# EAGLE design vco (EAGLE 7.5.0)
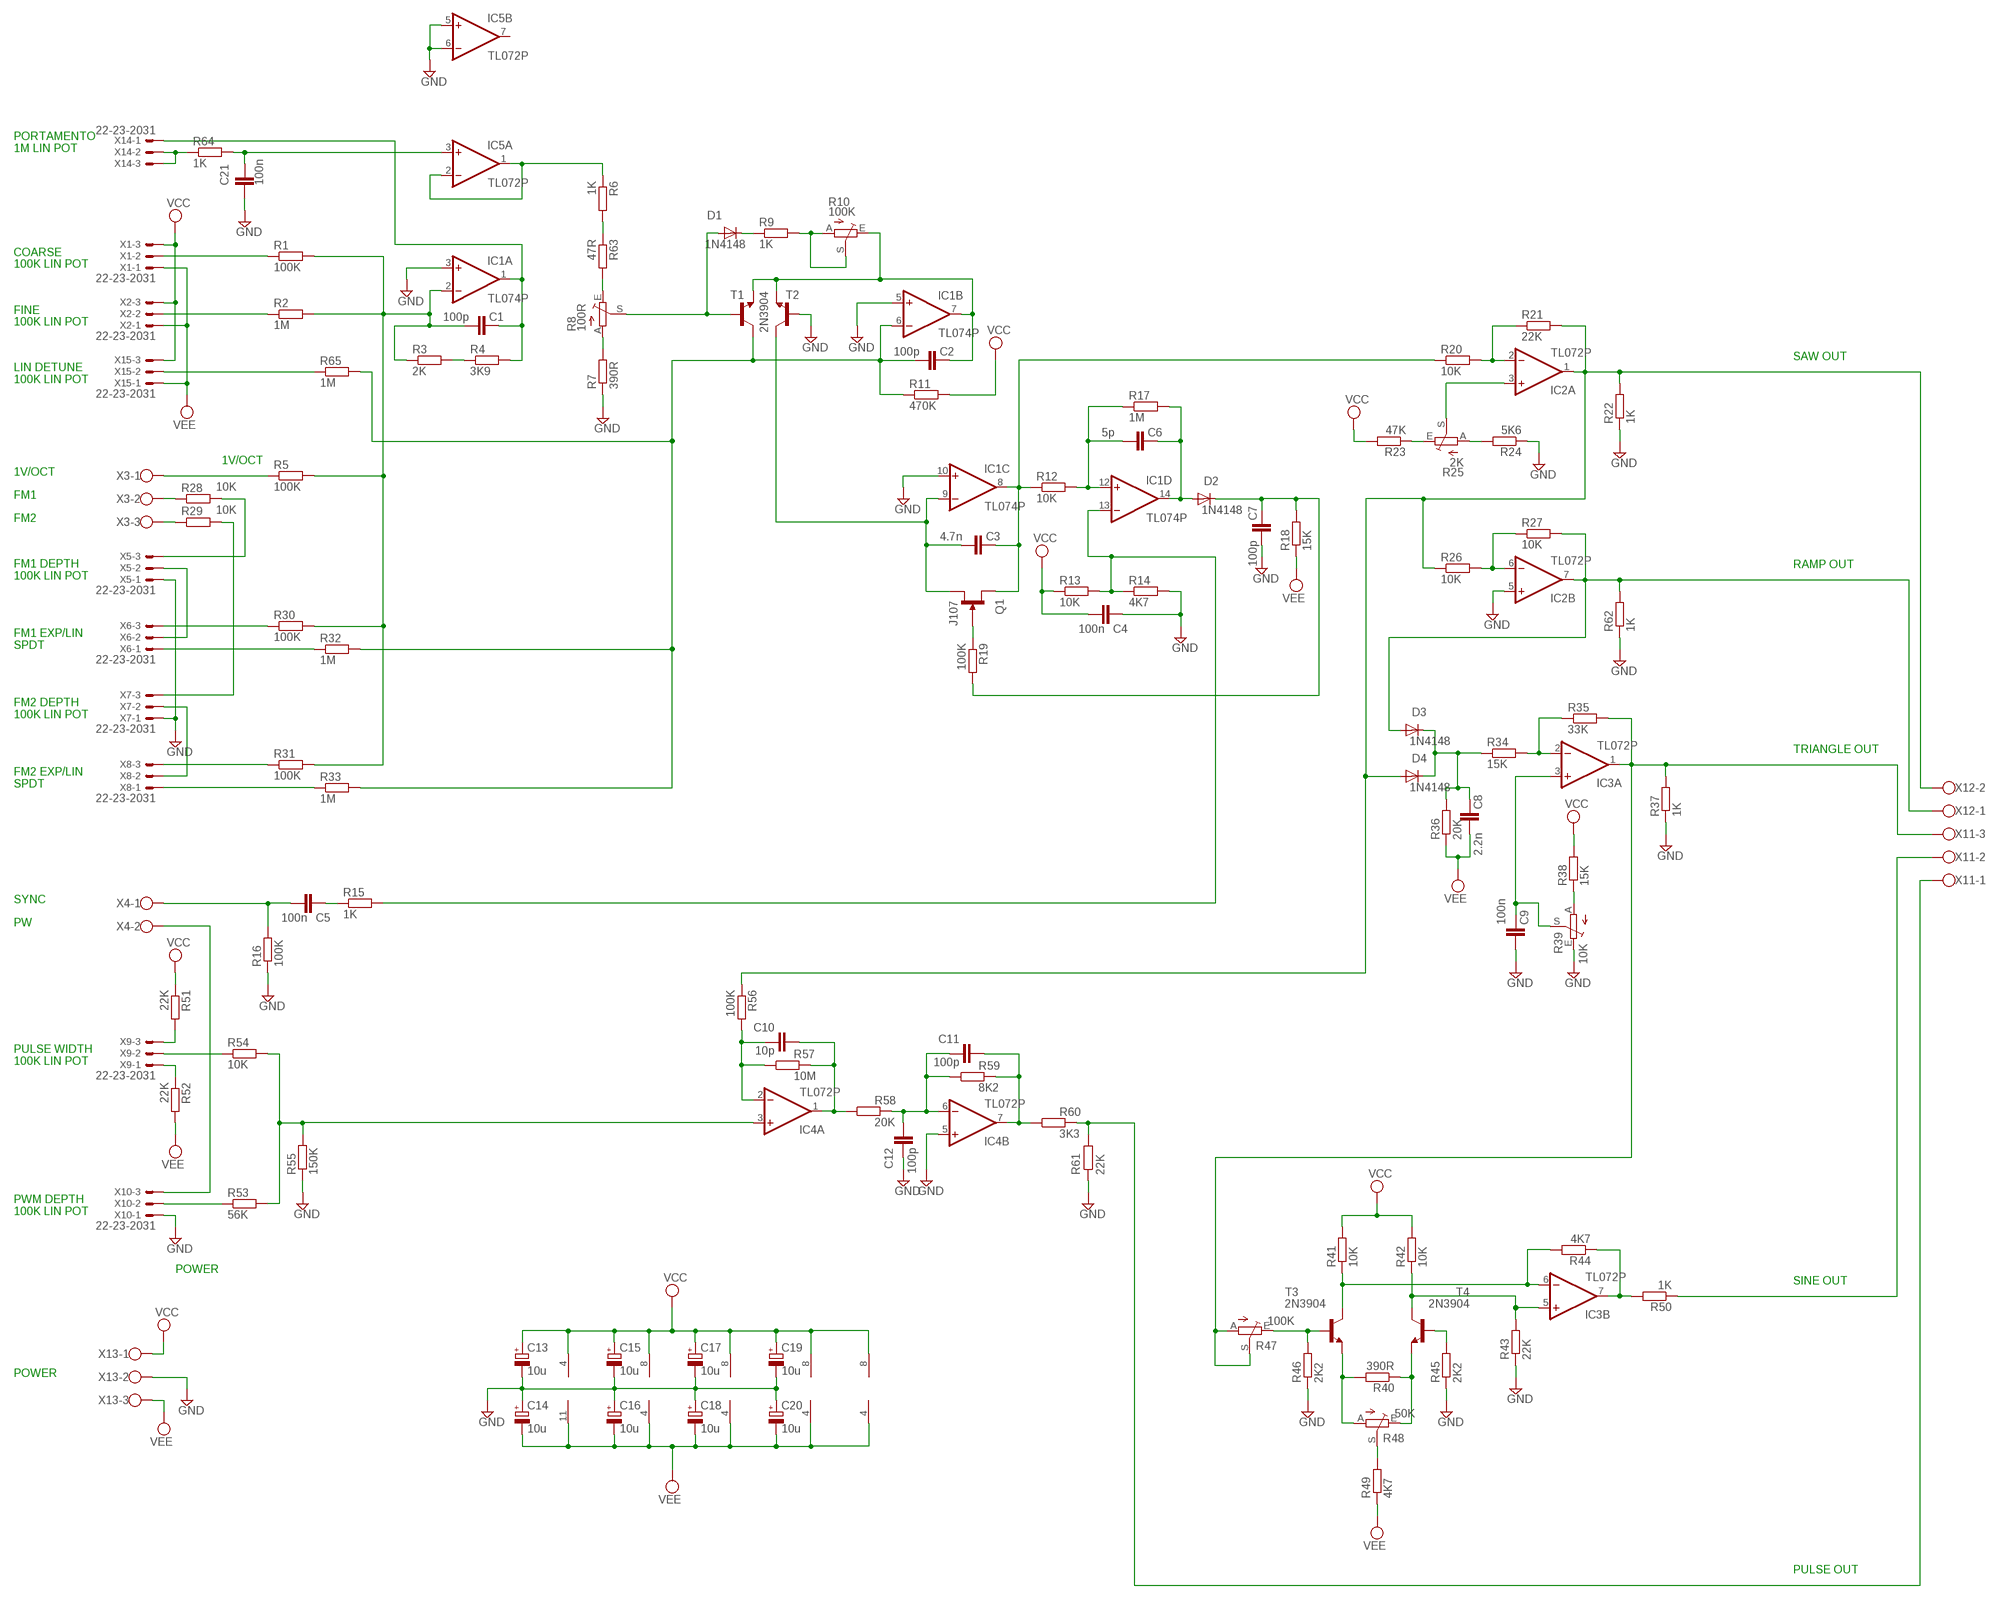
[diagram p0: schematic, sheet 1]

## Parts
C1  100p  C-EU025-024X044  [C025-024X044]
C2  100p  C-EU025-024X044  [C025-024X044]
C3  4.7n  C-EU025-024X044  [C025-024X044]
C4  100n  C-EU025-024X044  [C025-024X044]
C5  100n  C-EU025-024X044  [C025-024X044]
C6  5p  C-EU025-024X044  [C025-024X044]
C7  100p  C-EU025-024X044  [C025-024X044]
C8  2.2n  C-EU025-024X044  [C025-024X044]
C9  100n  C-EU025-024X044  [C025-024X044]
C10  10p  C-EU025-024X044  [C025-024X044]
C11  100p  C-EU025-024X044  [C025-024X044]
C12  100p  C-EU025-024X044  [C025-024X044]
C13  10u  CPOL-EUE1.8-4  [E1,8-4]
C14  10u  CPOL-EUE1.8-4  [E1,8-4]
C15  10u  CPOL-EUE1.8-4  [E1,8-4]
C16  10u  CPOL-EUE1.8-4  [E1,8-4]
C17  10u  CPOL-EUE1.8-4  [E1,8-4]
C18  10u  CPOL-EUE1.8-4  [E1,8-4]
C19  10u  CPOL-EUE1.8-4  [E1,8-4]
C20  10u  CPOL-EUE1.8-4  [E1,8-4]
C21  100n  C-EU025-024X044  [C025-024X044]
D1  1N4148  1N4148DO35-7  [DO35-7]
D2  1N4148  1N4148DO35-7  [DO35-7]
D3  1N4148  1N4148DO35-7  [DO35-7]
D4  1N4148  1N4148DO35-7  [DO35-7]
IC1  TL074P  [DIL14]
IC2  TL072P  [DIL08]
IC3  TL072P  [DIL08]
IC4  TL072P  [DIL08]
IC5  TL072P  [DIL08]
Q1  J107  J105  [TO92R]
R1  100K  R-EU_0204/7  [0204/7]
R2  1M  R-EU_0204/7  [0204/7]
R3  2K  R-EU_0309/12  [0309/12]
R4  3K9  R-EU_0204/7  [0204/7]
R5  100K  R-EU_0204/7  [0204/7]
R6  1K  R-EU_0204/7  [0204/7]
R7  390R  R-EU_0204/7  [0204/7]
R8  100R  TRIM_EU-B64Y  [B64Y]
R9  1K  R-EU_0204/7  [0204/7]
R10  100K  TRIM_EU-B64Y  [B64Y]
R11  470K  R-EU_0204/7  [0204/7]
R12  10K  R-EU_0204/7  [0204/7]
R13  10K  R-EU_0204/7  [0204/7]
R14  4K7  R-EU_0204/7  [0204/7]
R15  1K  R-EU_0204/7  [0204/7]
R16  100K  R-EU_0204/7  [0204/7]
R17  1M  R-EU_0204/7  [0204/7]
R18  15K  R-EU_0204/7  [0204/7]
R19  100K  R-EU_0204/7  [0204/7]
R20  10K  R-EU_0204/7  [0204/7]
R21  22K  R-EU_0204/7  [0204/7]
R22  1K  R-EU_0204/7  [0204/7]
R23  47K  R-EU_0204/7  [0204/7]
R24  5K6  R-EU_0204/7  [0204/7]
R25  2K  TRIM_EU-B64Y  [B64Y]
R26  10K  R-EU_0204/7  [0204/7]
R27  10K  R-EU_0204/7  [0204/7]
R28  10K  R-EU_0204/7  [0204/7]
R29  10K  R-EU_0204/7  [0204/7]
R30  100K  R-EU_0204/7  [0204/7]
R31  100K  R-EU_0204/7  [0204/7]
R32  1M  R-EU_0204/7  [0204/7]
R33  1M  R-EU_0204/7  [0204/7]
R34  15K  R-EU_0204/7  [0204/7]
R35  33K  R-EU_0204/7  [0204/7]
R36  20K  R-EU_0204/7  [0204/7]
R37  1K  R-EU_0204/7  [0204/7]
R38  15K  R-EU_0204/7  [0204/7]
R39  10K  TRIM_EU-CA6V  [CA6V]
R40  390R  R-EU_0204/7  [0204/7]
R41  10K  R-EU_0204/7  [0204/7]
R42  10K  R-EU_0204/7  [0204/7]
R43  22K  R-EU_0204/7  [0204/7]
R44  4K7  R-EU_0204/7  [0204/7]
R45  2K2  R-EU_0204/7  [0204/7]
R46  2K2  R-EU_0204/7  [0204/7]
R47  100K  TRIM_EU-CA6V  [CA6V]
R48  50K  TRIM_EU-CA6V  [CA6V]
R49  4K7  R-EU_0204/7  [0204/7]
R50  1K  R-EU_0204/7  [0204/7]
R51  22K  R-EU_0204/7  [0204/7]
R52  22K  R-EU_0204/7  [0204/7]
R53  56K  R-EU_0204/7  [0204/7]
R54  10K  R-EU_0204/7  [0204/7]
R55  150K  R-EU_0204/7  [0204/7]
R56  100K  R-EU_0204/7  [0204/7]
R57  10M  R-EU_0204/7  [0204/7]
R58  20K  R-EU_0204/7  [0204/7]
R59  8K2  R-EU_0204/7  [0204/7]
R60  3K3  R-EU_0204/7  [0204/7]
R61  22K  R-EU_0204/7  [0204/7]
R62  1K  R-EU_0204/7  [0204/7]
R63  47R  R-EU_0204/7  [0204/7]
R64  1K  R-EU_0204/7  [0204/7]
R65  1M  R-EU_0204/7  [0204/7]
T1  2N3904  [TO92]
T2  2N3904  [TO92]
T3  2N3904  [TO92]
T4  2N3904  [TO92]
X1  22-23-2031  [22-23-2031]
X2  22-23-2031  [22-23-2031]
X3  W237-103  [W237-103]
X4  W237-102  [W237-102]
X5  22-23-2031  [22-23-2031]
X6  22-23-2031  [22-23-2031]
X7  22-23-2031  [22-23-2031]
X8  22-23-2031  [22-23-2031]
X9  22-23-2031  [22-23-2031]
X10  22-23-2031  [22-23-2031]
X11  W237-103  [W237-103]
X12  W237-102  [W237-102]
X13  W237-103  [W237-103]
X14  22-23-2031  [22-23-2031]
X15  22-23-2031  [22-23-2031]

## Nets
GND: C4.1 C7.2 C9.2 C12.1 C13.- C14.+ C15.- C16.+ C17.- C18.+ C19.- C20.+ C21.2 IC1.3(A:+IN) IC1.5(B:+IN) IC1.10(C:+IN) IC2.5(B:+IN) IC4.5(B:+IN) IC5.5(B:+IN) IC5.6(B:-IN) R7.1 R14.2 R16.1 R22.1 R24.1 R37.1 R39.E R43.1 R45.1 R46.1 R55.1 R61.1 R62.1 T2.2(B) X5.1 X7.1 X10.1 X13.2
N$1: R1.1 X1.2
N$2: C1.1 IC1.1(A:OUT) R4.2 X14.1
N$3: R3.2 R4.1
N$4: R6.2 R63.1
N$5: R7.2 R8.A
N$6: C2.1 IC1.7(B:OUT) R10.E T1.3(E) T2.3(E)
N$7: D1.A R8.S T1.2(B)
N$8: D1.C R9.1
N$9: R9.2 R10.A R10.S
N$10: C6.2 IC1.12(D:+IN) R12.2 R17.1
N$11: IC1.13(D:-IN) R13.2 R14.1 R15.2
N$12: C10.1 IC4.2(A:-IN) R56.2 R57.1
N$13: C3.2 IC1.9(C:-IN) Q1.S T2.1(C)
N$14: C3.1 IC1.8(C:OUT) Q1.D R12.1 R20.1
N$15: C7.1 D2.C R18.2 R19.2
N$16: C5.1 R15.1
N$17: C5.2 R16.2 X4.1
N$18: C6.1 D2.A IC1.14(D:OUT) R17.2
N$19: R23.1 R25.E
N$20: Q1.G R19.1
N$21: R24.2 R25.A
N$22: IC2.2(A:-IN) R20.2 R21.1
N$23: R2.1 X2.2
N$24: IC3.2(A:-IN) R34.2 R35.1
N$25: IC2.3(A:+IN) R25.S
N$26: IC2.6(B:-IN) R26.2 R27.1
N$27: R28.1 X3.2
N$28: R5.1 X3.1
N$29: R29.1 X3.3
N$30: R29.2 X7.3
N$31: R28.2 X5.3
N$32: X5.2 X6.2
N$33: X7.2 X8.2
N$34: R30.1 X6.3
N$35: R31.1 X8.3
N$36: R32.1 X6.1
N$37: R33.1 X8.1
N$38: R52.1 X9.1
N$39: C8.1 D3.C D4.C R34.1 R36.2
N$40: R51.2 X9.3
N$41: R54.1 X9.2
N$43: R38.1 R39.A
N$44: C9.1 IC3.3(A:+IN) R39.S
N$45: R40.2 R48.A T3.3(E)
N$46: R40.1 R48.E T4.3(E)
N$47: IC3.6(B:-IN) R41.1 R44.2 T3.1(C)
N$48: IC3.5(B:+IN) R42.1 R43.2 T4.1(C)
N$49: X4.2 X10.3
N$50: C10.2 IC4.1(A:OUT) R57.2 R58.1
N$51: IC3.7(B:OUT) R44.1 R50.2
N$52: R45.2 T4.2(B)
N$53: R46.2 R47.E T3.2(B)
N$54: C11.1 C12.2 IC4.6(B:-IN) R58.2 R59.1
N$55: C11.2 IC4.7(B:OUT) R59.2 R60.1
N$56: R48.S R49.2
N$57: R8.E R63.2
N$58: R64.1 X14.2 X14.3
N$59: C21.1 IC5.3(A:+IN) R64.2
N$60: IC5.1(A:OUT) IC5.2(A:-IN) R6.1
N$61: R65.1 X15.2
N$65: R53.1 X10.2
N$EXP-CV1: C1.2 IC1.2(A:-IN) R1.2 R2.2 R3.1 R5.2 R30.2 R31.2
N$LIN-CV1: C2.2 IC1.6(B:-IN) R11.1 R32.2 R33.2 R65.2 T1.1(C)
N$PULSE-OUT1: R60.2 R61.2 X11.1
N$PW-CV1: IC4.3(A:+IN) R53.2 R54.2 R55.2
N$SAW-OUT1: D4.A IC2.1(A:OUT) R21.2 R22.2 R26.1 R56.1 X12.2
N$SAW-OUT2: D3.A IC2.7(B:OUT) R27.2 R62.2 X12.1
N$SINE-OUT1: R50.1 X11.2
N$TRI-OUT1: IC3.1(A:OUT) R35.2 R37.2 R47.A R47.S X11.3
VCC: C4.2 C13.+ C15.+ C17.+ C19.+ IC1.4(P:V+) IC2.8(P:V+) IC3.8(P:V+) IC4.8(P:V+) IC5.8(P:V+) R11.2 R13.1 R23.2 R38.2 R41.2 R42.2 R51.1 X1.3 X2.3 X13.1 X15.3
VEE: C8.2 C14.- C16.- C18.- C20.- IC1.11(P:V-) IC2.4(P:V-) IC3.4(P:V-) IC4.4(P:V-) IC5.4(P:V-) R18.1 R36.1 R49.1 R52.2 X1.1 X2.1 X13.3 X15.1
Unconnected: IC5.7(B:OUT)

## Notes on the sheet
- PORTAMENTO
  1M LIN POT
- COARSE
- 100K LIN POT
- FINE
- 100K LIN POT
- SAW OUT
- LIN DETUNE
  100K LIN POT
- 1V/OCT
- 1V/OCT
- FM1
- FM2
- RAMP OUT
- FM1 DEPTH
  100K LIN POT
- FM1 EXP/LIN
  SPDT
- FM2 DEPTH
  100K LIN POT
- TRIANGLE OUT
- FM2 EXP/LIN
  SPDT
- SYNC
- PW
- PULSE WIDTH
  100K LIN POT
- PWM DEPTH
  100K LIN POT
- POWER
- SINE OUT
- POWER
- PULSE OUT

## Library data of the parts
C1-C12 C21 = rcl:C-EU: CAPACITOR, European symbol
C13-C20 = rcl:CPOL-EU: POLARIZED CAPACITOR, European symbol
D1-D4 = diode:1N4148: DIODE high speed (Philips)
IC1 = linear:TL074: OP AMP
IC2-IC5 = linear:TL072: OP AMP
Q1 = transistor-small-signal:J105: N-CHANNEL FET J105, J106, J107 Source: http://www.fairchildsemi.com/pf/J1/J105.html
R1-R7 R9 R11-R24 R26-R38 R40-R46 R49-R65 = resistor:R-EU_: RESISTOR, European symbol
R8 R10 R25 R39 R47 R48 = pot:TRIM_EU-: POTENTIOMETER
T1-T4 = transistor:2N3904: NPN TRANSISTOR
X1 X2 X5-X10 X14 X15 = con-molex:22-23-2031: .100" (2.54mm) Center Header - 3 Pin; MF: MOLEX; MPN: 22-23-2031; OC_FARNELL: 1462950; OC_NEWARK: 30C0862
X3 X11 X13 = con-wago-500:W237-103: WAGO SCREW CLAMP; MPN: 237-103; OC_FARNELL: unknown; OC_NEWARK: 18M7116
X4 X12 = con-wago-500:W237-102: WAGO SCREW CLAMP; MPN: 237-102; OC_FARNELL: unknown; OC_NEWARK: 70K9898

## Board
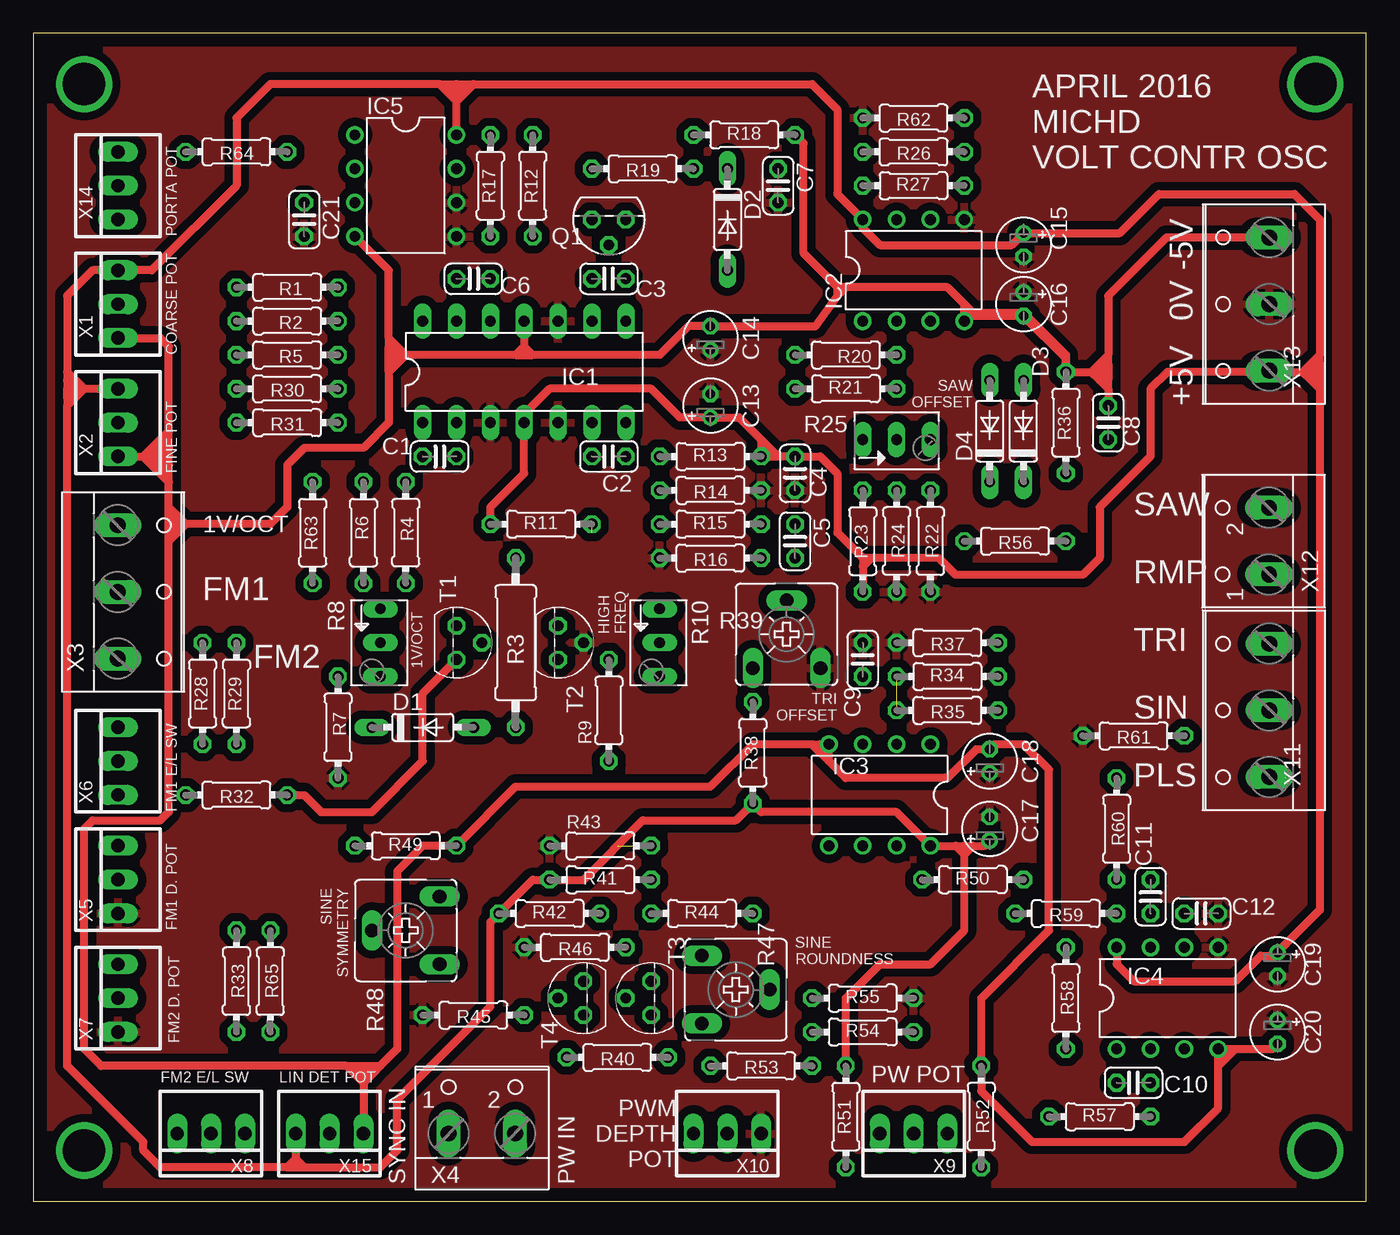
[diagram p1: board, top side]
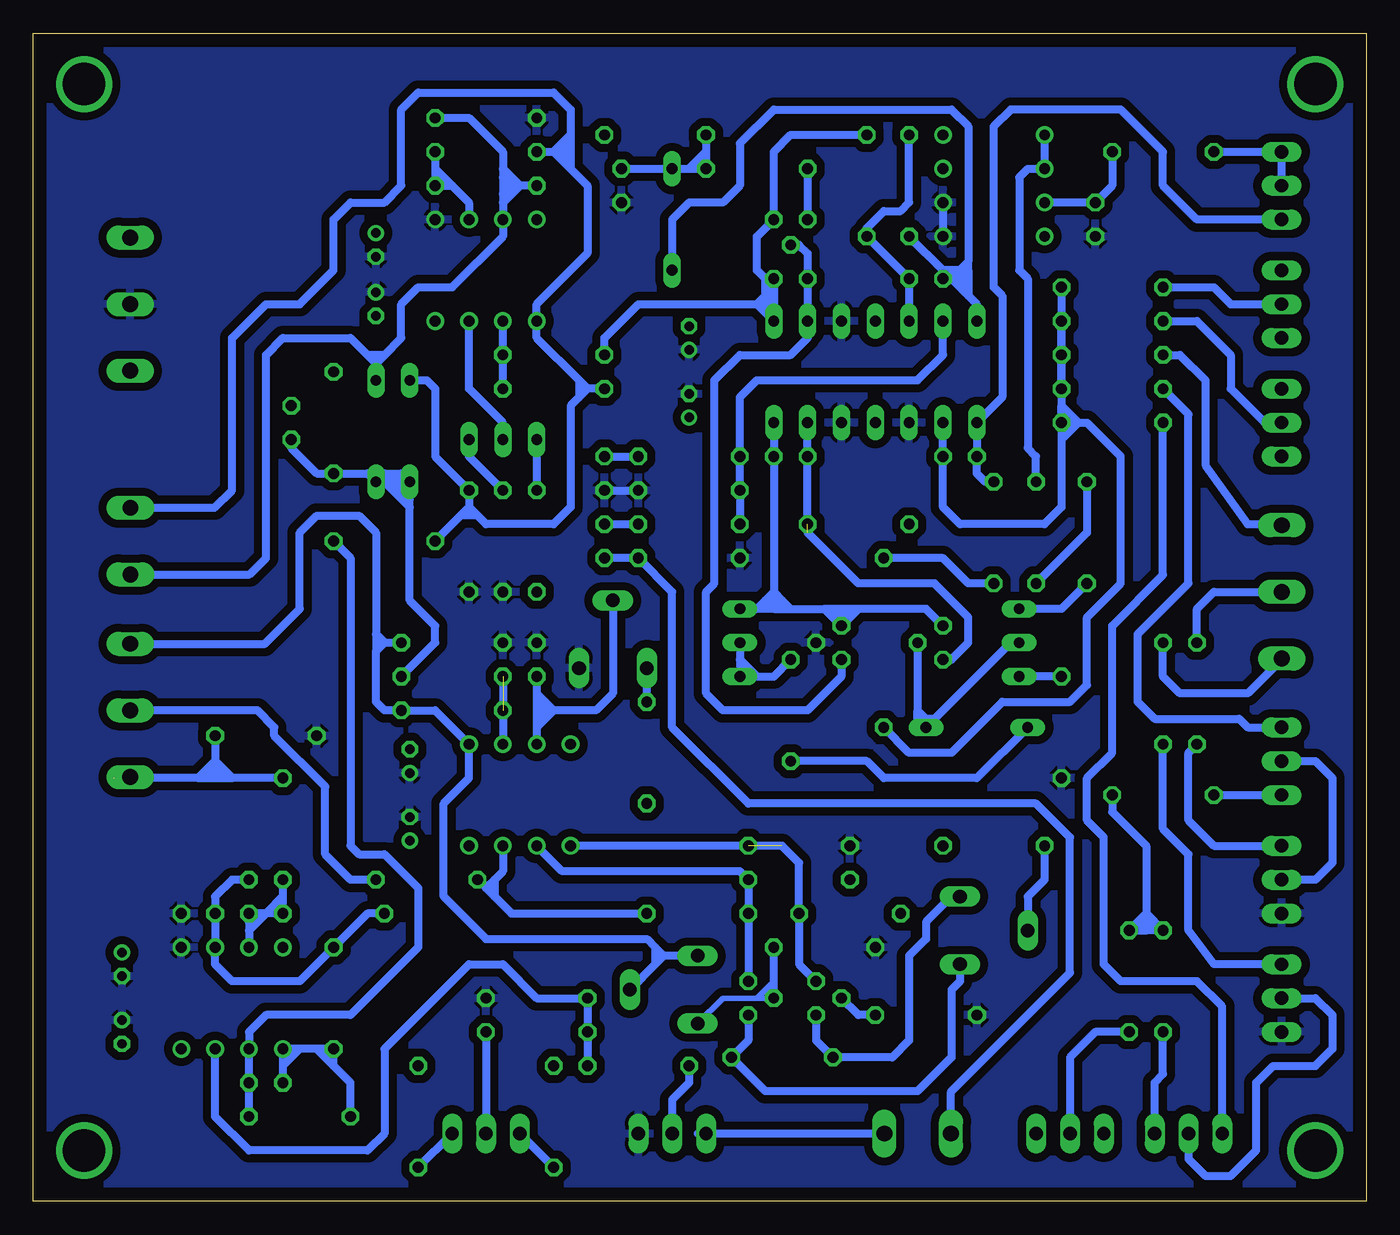
[diagram p2: board, bottom side, seen from below]

Size 100 x 87.63 mm. Coordinates in mm from the lower left corner, seen from the top.
Outline: 0,0 100,0 100,87.63 0,87.63 0,0
Copper layers (1*16): Top 0.035mm / dielectric 1.5mm / Bottom 0.035mm
Design rules "default": minimum track width 10mil, minimum drill 24mil, track to track 8mil, track to pad 8mil, pad to pad 8mil, via to via 8mil, smd to smd 8mil, copper to edge 40mil, drill to drill 8mil, minimum pad ring 10mil, minimum via ring 8mil, stop-mask expansion 4mil, vias tented up to drill 0mil, thermal gap 10mil

### Footprints (pad centres in the part's own frame; a part is rotated, then mirrored left to right if it is on the bottom)
C025-024X044 = drill 0.813 octagon: 1 -1.27,0; 2 1.27,0
E1,8-4 = drill 0.711 pad 1.168: + -0.889,0 | drill 0.711 pad 1.168 octagon: - 0.889,0
DO35-7 = drill 0.813 long: A 3.81,0; C -3.81,0
DIL14 = drill 0.813 long: 1 -7.62,-3.81; 2 -5.08,-3.81; 3 -2.54,-3.81; 4 0,-3.81; 5 2.54,-3.81; 6 5.08,-3.81; 7 7.62,-3.81; 8 7.62,3.81; 9 5.08,3.81; 10 2.54,3.81; 11 0,3.81; 12 -2.54,3.81; 13 -5.08,3.81; 14 -7.62,3.81
DIL08 = drill 0.813 pad 1.27: 1 -3.81,-3.81; 2 -1.27,-3.81; 3 1.27,-3.81; 4 3.81,-3.81; 5 3.81,3.81; 6 1.27,3.81; 7 -1.27,3.81; 8 -3.81,3.81
TO92R = drill 0.813 octagon: D -1.27,0; G 1.27,0; S 0,1.905
0204/7 = drill 0.813 octagon: 1 -3.81,0; 2 3.81,0
0309/12 = drill 0.813 octagon: 1 -6.35,0; 2 6.35,0
B64Y = drill 0.813 long: A 2.54,0; E -2.54,0; S 0,0
CA6V = drill 1.016 long: A -2.54,-2.54; E 2.54,-2.54; S 0,2.54
TO92 = drill 0.813 octagon: 1 1.27,0; 2 0,1.905; 3 -1.27,0
22-23-2031 = drill 1 long: 1 -2.54,0; 2 0,0; 3 2.54,0
W237-103 = drill 1.194 long: 1 -5,-1.29; 2 0,-1.29; 3 5,-1.29
W237-102 = drill 1.194 long: 1 -2.5,-1.27; 2 2.5,-1.27

### Placement (x,y rotation side)
C1  30.48,55.88 0 top
C2  43.18,55.88 180 top
C3  43.18,69.22 180 top
C4  57.15,54.61 90 top
C5  57.15,49.53 270 top
C6  33.02,69.22 0 top
C7  55.88,76.2 270 top
C8  80.64,58.42 90 top
C9  62.23,40.64 90 top
C10  82.55,8.89 180 top
C11  83.82,22.86 270 top
C12  87.63,21.59 180 top
C13  50.8,59.69 90 top
C14  50.8,64.77 90 top
C15  74.3,71.75 270 top
C16  74.3,67.31 270 top
C17  71.75,27.94 90 top
C18  71.75,33.02 90 top
C19  93.34,17.78 270 top
C20  93.34,12.7 270 top
C21  20.32,73.66 270 top
D1  29.21,35.56 0 top
D2  52.07,73.66 270 top
D3  74.3,57.78 90 top
D4  71.75,57.78 90 top
IC1  36.83,62.23 0 top
IC2  66.04,69.85 0 top
IC3  63.5,30.48 180 top
IC4  85.09,15.24 0 top
IC5  27.94,76.2 270 top
Q1  43.18,73.66 180 top
R1  19.05,68.58 0 top
R2  19.05,66.04 0 top
R3  36.2,41.91 90 top
R4  27.94,50.16 90 top
R5  19.05,63.5 0 top
R6  24.77,50.16 270 top
R7  22.86,35.56 90 top
R8  26.04,41.91 270 top
R9  43.18,36.83 90 top
R10  46.99,41.91 270 top
R11  38.1,50.8 180 top
R12  37.47,76.2 270 top
R13  50.8,55.88 180 top
R14  50.8,53.34 0 top
R15  50.8,50.8 180 top
R16  50.8,48.26 0 top
R17  34.29,76.2 270 top
R18  53.34,80.01 180 top
R19  45.72,77.47 0 top
R20  60.96,63.5 0 top
R21  60.96,60.96 180 top
R22  67.31,49.53 90 top
R23  62.23,49.53 270 top
R24  64.77,49.53 90 top
R25  64.77,57.15 0 top
R26  66.04,78.74 0 top
R27  66.04,76.2 180 top
R28  12.7,38.1 270 top
R29  15.24,38.1 270 top
R30  19.05,60.96 0 top
R31  19.05,58.42 0 top
R32  15.24,30.48 0 top
R33  15.24,16.51 90 top
R34  68.58,39.37 180 top
R35  68.58,36.83 0 top
R36  77.47,58.42 270 top
R37  68.58,41.91 0 top
R38  53.98,33.66 270 top
R39  56.52,42.55 0 top
R40  43.81,10.79 0 top
R41  42.55,24.13 180 top
R42  38.73,21.59 180 top
R43  42.55,26.67 0 top
R44  50.16,21.59 180 top
R45  33.02,13.97 0 top
R46  40.64,19.05 0 top
R47  52.7,15.88 270 top
R48  27.94,20.32 90 top
R49  27.94,26.67 180 top
R50  70.48,24.13 180 top
R51  60.96,6.35 270 top
R52  71.12,6.35 90 top
R53  54.61,10.16 0 top
R54  62.23,12.7 180 top
R55  62.23,15.24 180 top
R56  73.66,49.53 0 top
R57  80.01,6.35 180 top
R58  77.47,15.24 90 top
R59  77.47,21.59 0 top
R60  81.28,27.94 90 top
R61  82.55,34.92 0 top
R62  66.04,81.28 0 top
R63  20.95,50.16 270 top
R64  15.24,78.74 0 top
R65  17.78,16.51 90 top
T1  31.75,41.91 270 top
T2  39.37,41.91 270 top
T3  46.35,15.24 90 top
T4  41.27,15.24 90 top
X1  6.35,67.31 90 top
X2  6.35,58.42 90 top
X3  7.62,45.72 270 top
X4  33.66,6.35 0 top
X5  6.35,24.13 90 top
X6  6.35,33.02 90 top
X7  6.35,15.24 90 top
X8  13.34,5.08 180 top
X9  66.04,5.08 180 top
X10  52.07,5.08 180 top
X11  91.44,36.83 90 top
X12  91.44,49.53 90 top
X13  91.44,67.31 90 top
X14  6.35,76.2 90 top
X15  22.23,5.08 180 top

### Tracks (layer width: path | path; a pad name or v marks a point on that pad's centre or on a via)
GND
  Bottom 0.61: IC5.6 IC5.5 | C4.1 R14.2
  pour Top (isolate 0.61): 0,87.63 100.33,87.63 100.33,0 0,0
  pour Bottom (isolate 0.61): 0,87.63 99.69,87.63 99.69,0 0,0
N$1
  Bottom 0.61: R1.1 11.43,68.58 10.16,67.31 X1.2
N$2
  Bottom 0.61: X14.1 12.7,73.66 15.24,76.2 15.24,78.74 18.41,81.92 26.67,81.92 27.94,80.64 27.94,68.58 27.3,67.94 27.3,60.33 IC1.1 C1.1 29.21,54.61 28.57,53.98 R4.2
N$3
  Bottom 0.61: R4.1 29.84,46.35 31.75,48.26 R3.2
N$4
  Bottom 0.61: R63.1 20.95,50.16 R6.2
N$5
  Bottom 0.61: R7.2 R8.A
N$6
  Bottom 0.61: T1.3 33.02,44.45 38.1,44.45 | 38.1,44.45 T2.3 | R10.E 45.72,44.45 | 44.45,44.45 43.18,44.45 | 43.18,44.45 40.64,44.45 | 40.64,44.45 T2.3 | 38.1,44.45 38.73,44.45 | 38.73,44.45 39.37,44.45 | 39.37,44.45 40.01,44.45 | 40.01,44.45 40.64,44.45 | T2.3 39.37,43.81 | 39.37,43.81 39.37,44.45 | 38.73,44.45 39.37,43.81 | 39.37,43.81 40.01,44.45 | IC1.7 C2.1 44.45,45.72 | 44.45,45.72 44.45,44.45 | 44.45,45.72 43.81,45.09 | 43.81,45.09 43.18,44.45 | 44.45,44.45 45.72,44.45 | 45.72,44.45 45.09,45.09 | 45.09,45.09 44.45,45.72 | 44.45,44.45 45.09,45.09 | 45.09,45.09 43.81,45.09 | 43.81,45.09 44.45,44.45
N$7
  Bottom 0.61: T1.2 33.66,36.83 | 33.66,36.2 D1.A 32.38,36.2 | R8.S 26.67,41.91 32.38,36.2 | 32.38,36.2 33.02,36.2 | 33.02,36.2 33.66,36.2 | 33.66,36.2 33.66,36.83 | 33.66,36.83 33.02,36.2
N$8
  Bottom 0.61: D1.C 29.21,31.75 36.2,31.75 37.47,33.02 R9.1
N$9
  Bottom 0.61: 45.72,39.37 R10.A | R10.S 46.99,40.64 | 45.72,39.37 46.35,40.01 | 46.35,40.01 46.99,40.64 | 46.99,40.64 R10.A | R10.A 46.35,40.01 | 45.72,39.37 44.45,39.37 R9.2
N$10
  Bottom 0.61: IC1.12 C6.2 R12.2 37.47,73.03 36.2,74.3 34.92,74.3 34.29,74.93 R17.1
N$11
  Bottom 0.61: IC1.13 31.75,63.5 33.66,61.59 45.72,61.59 46.99,60.33 R13.2 R14.1 R15.2
N$12
  Bottom 0.61: R57.1 C10.1 IC4.2 83.82,12.7 82.55,13.97 76.2,13.97 71.12,19.05 71.12,23.5 73.66,26.04 75.56,26.04 76.2,26.67 76.2,48.26 R56.2
N$13
  Bottom 0.61: T2.1 39.37,39.37 41.91,36.83 48.26,36.83 49.53,38.1 49.53,45.72 48.9,46.35 48.9,61.59 46.99,63.5 43.18,63.5 41.91,64.77 IC1.9 C3.2 41.91,71.12 42.55,71.75 Q1.S
N$14
  Bottom 0.61: 44.45,67.31 IC1.8 45.09,66.67 | C3.1 45.09,69.22 | 45.09,69.22 45.72,69.85 45.72,72.39 Q1.D 44.45,78.74 43.18,80.01 R12.1 | R20.1 57.15,64.77 54.61,67.31 45.72,67.31 | 45.72,67.31 45.09,67.94 | C3.1 44.45,67.94 | 44.45,67.94 44.45,67.31 | 44.45,67.31 45.09,67.31 | 45.09,67.31 45.72,67.31 | 45.72,67.31 45.09,66.67 | 45.09,66.67 45.09,67.31 | 45.09,67.31 45.09,67.94 | 45.09,67.31 44.45,67.94 | C3.1 45.09,67.94 | 45.09,67.94 45.09,69.22
N$15
  Bottom 0.61: D2.C R19.2 | C7.1 D2.C | D2.C 50.8,77.47 | R18.2 49.53,78.74 | 49.53,78.74 R19.2 | R19.2 50.8,77.47 | 50.8,77.47 49.53,78.74
N$16
  Bottom 0.61: C5.1 R15.1
N$17
  Bottom 0.61: C5.2 R16.2 52.07,45.72 52.07,35.56 46.35,29.84 24.77,29.84 22.23,27.3 22.23,17.14 31.16,8.21 X4.1 31.16,5.04
N$18
  Bottom 0.61: 31.11,69.22 C6.1 31.75,69.85 | 31.11,69.22 30.48,68.58 | 30.48,68.58 29.84,67.94 | 29.84,67.94 29.21,67.31 IC1.14 | R17.2 31.75,69.85 | 31.75,69.85 31.11,69.22 | 29.84,70.48 29.84,80.64 31.11,81.92 44.45,81.92 46.99,79.38 46.99,76.2 48.26,74.93 50.8,74.93 52.07,73.66 D2.A | 29.84,69.85 29.84,69.22 | 29.84,69.22 29.84,67.94 | 29.84,69.85 30.48,69.85 | 30.48,69.85 31.75,69.85 | 29.84,69.85 29.84,70.48 | 29.84,70.48 30.48,69.85 | 30.48,69.85 30.48,68.58 | 30.48,68.58 29.84,69.22 | 29.84,69.22 30.48,69.85 | 30.48,69.85 31.11,69.22
N$19
  Bottom 0.61: R25.E R23.1
N$20
  Bottom 0.61: R19.1 Q1.G
N$21
  Bottom 0.61: R25.A 67.31,55.88 R24.2
N$22
  Bottom 0.61: R21.1 R20.2 IC2.2
N$23
  Bottom 0.61: R2.1 12.7,66.04 10.16,63.5 10.16,60.96 7.62,58.42 X2.2
N$24  (1 unrouted)
  Bottom 0.61: R34.2 IC3.2
N$25
  Bottom 0.61: R25.S 64.77,58.42 67.31,60.96 IC2.3
N$26
  Bottom 0.61: R26.2 69.85,77.47 | 69.85,76.83 R27.1 69.22,76.2 | 69.22,76.2 68.58,76.2 | 68.58,76.2 67.31,74.93 IC2.6 | 68.58,76.2 69.85,77.47 | 69.85,77.47 69.85,76.83 | 69.85,76.83 69.22,76.2
N$27
  Bottom 0.61: R28.1 12.7,44.45 11.43,45.72 X3.2
N$28
  Bottom 0.61: R5.1 13.97,63.5 12.06,61.59 12.06,55.24 8.89,50.8 6.41,50.8 X3.1
N$29
  Bottom 0.61: X3.3 6.41,40.64 6.41,40.58 8.89,38.1 13.97,38.1 15.24,39.37 R29.1
N$30
  Bottom 0.61: X7.3 11.43,17.78 13.34,20.32 13.34,26.04 15.24,27.94 R29.2
N$31
  Bottom 0.61: X5.3 11.43,26.67 13.34,28.57 13.34,33.66 R28.2
N$32
  Bottom 0.61: X6.2 3.81,33.02 2.54,31.75 2.54,25.4 3.81,24.13 X5.2
N$33
  Bottom 0.61: X7.2 3.81,15.24 2.54,13.97 2.54,11.43 3.81,10.16 6.99,10.16 8.26,8.89 8.26,3.81 10.16,1.91 12.06,1.91 13.34,3.17 X8.2
N$34
  Bottom 0.61: X6.3 8.89,35.56 9.53,36.2 15.88,36.2 17.14,37.47 17.14,42.55 13.34,46.35 13.34,59.05 R30.1
N$35
  Bottom 0.61: R31.1 15.24,46.99 19.05,43.18 19.05,33.66 20.95,31.75 20.95,28.57 19.68,27.3 19.68,17.78 18.41,16.51 12.7,16.51 10.79,14.61 X8.3
N$36
  Bottom 0.61: R32.1 X6.1
N$37
  Bottom 0.61: X8.1 15.88,8.89 15.24,9.53 R33.1
N$38
  Bottom 0.61: R52.1 X9.1
N$39
  Bottom 0.61: 73.66,53.98 D3.C 74.93,54.61 | 74.93,54.61 R36.2 78.74,54.61 80.64,56.52 C8.1 | R34.1 69.85,41.91 69.85,43.18 71.75,45.09 71.75,52.07 | 71.75,52.07 71.75,52.7 | 71.75,52.7 D4.C | 71.75,52.7 72.39,53.34 | 72.39,53.34 73.03,53.98 | 73.03,53.98 73.66,53.98 | 73.66,53.98 71.75,52.07 | 72.39,54.61 71.75,54.61 D4.C | 74.93,54.61 73.66,54.61 | 72.39,54.61 72.39,53.34 | 73.03,53.98 73.66,54.61 | 73.66,54.61 72.39,54.61 | 72.39,54.61 73.03,53.98 | 73.03,53.98 D4.C
N$40
  Bottom 0.61: R51.2 X9.3
N$41
  Bottom 0.61: R54.1 X9.2
N$42  (via drill 3.2 pad 3.81)
  other vias: 3.81,3.81
N$43
  Bottom 0.61: R38.1 R39.A
N$44
  Bottom 0.61: C9.1 62.23,38.1 | 62.23,38.1 62.23,37.47 | 62.23,36.83 62.23,36.2 | 62.23,36.2 62.23,35.56 | 62.23,35.56 IC3.3 | R39.S 56.52,38.1 57.78,36.83 60.96,36.83 | 60.96,36.83 61.59,36.83 | 61.59,36.83 62.23,36.83 | 61.59,36.83 62.23,37.47 | 62.23,37.47 62.23,36.83 | 62.23,36.2 61.59,36.83 | 61.59,36.83 61.59,37.47 | 61.59,37.47 62.23,38.1 | 61.59,37.47 60.96,36.83 | 60.96,36.83 62.23,35.56
N$45
  Bottom 0.61: T3.3 46.35,12.06 R40.2 45.09,8.26 33.66,8.26 31.11,10.79 31.11,15.88 30.48,16.51 R48.A
N$46
  Bottom 0.61: T4.3 41.27,12.06 R40.1 35.56,10.79 34.29,12.06 34.29,18.41 33.02,19.68 33.02,20.95 31.11,22.86 R48.E
N$47
  Bottom 0.61: IC3.6 60.33,24.77 46.99,24.77 R41.1 R44.2 T3.1
N$48  (1 unrouted)
  Bottom 0.61: T4.1 42.55,17.78 R42.1 42.55,25.4 43.81,26.67 IC3.5
N$49
  Bottom 0.61: X4.2 X10.3 50.16,5.08
N$50
  Bottom 0.61: 78.74,11.43 R58.1 77.47,10.16 | 78.74,11.43 80.01,11.43 | 80.01,11.43 80.64,11.43 | 80.64,11.43 IC4.1 81.28,10.79 | 77.47,10.16 78.74,11.43 | R57.2 76.2,8.89 77.47,10.16 | 81.28,10.16 C10.2 | 80.64,11.43 81.28,10.79 | 81.28,10.79 81.28,10.16 | 81.28,10.16 80.01,11.43
N$51
  Bottom 0.61: R44.1 64.14,21.59 65.41,22.86 | IC3.7 64.77,24.77 65.41,24.13 | 65.41,24.13 66.04,23.5 | 66.04,23.5 R50.2 | 65.41,22.86 66.04,23.5 | 65.41,24.13 65.41,22.86
N$52
  Bottom 0.61: R45.2 38.1,13.97 T4.2
N$53
  Bottom 0.406: T3.2 45.72,15.24 | 45.72,15.24 48.26,15.24 R47.E | 45.72,15.24 44.45,16.51
  Bottom 0.61: T3.2 44.45,16.51 R46.2
N$54
  Bottom 0.61: C11.1 85.09,24.13 86.36,22.86 C12.2 IC4.6 86.36,17.78 85.09,16.51 80.01,16.51 R58.2 74.93,21.59 R59.1
N$55
  Bottom 0.61: 83.82,20.95 C11.2 83.19,21.59 | 83.82,20.95 83.82,20.32 | 83.82,20.32 IC4.7 | 82.55,21.59 R59.2 81.28,22.86 | 82.55,21.59 83.19,21.59 | 83.82,20.95 83.19,21.59 | 83.82,20.32 82.55,21.59 | R60.1 81.28,22.86 | 81.28,22.86 82.55,21.59
N$56
  Bottom 0.61: R49.2 24.13,24.13 25.4,22.86 R48.S
N$57
  Bottom 0.61: R63.2 22.86,44.45 R8.E
N$58
  Bottom 0.61: X14.2 X14.3 R64.1
N$59
  Bottom 0.61: IC5.3 C21.1 19.05,76.2 R64.2
N$60
  Bottom 0.61: IC5.1 IC5.2 25.4,77.47 26.04,76.83 26.04,69.85 25.4,69.22 25.4,56.52 24.77,55.88 R6.1
N$61
  Bottom 0.61: R65.1 20.32,12.7 22.23,10.79 X15.2
N$62  (via drill 3.2 pad 3.81)
  other vias: 3.81,83.82
N$63  (via drill 3.2 pad 3.81)
  other vias: 96.19,83.82
N$64  (via drill 3.2 pad 3.81)
  other vias: 96.19,3.81
N$65
  Bottom 0.61: R53.1 50.8,8.89 52.07,7.62 X10.2
N$EXP-CV1
  Bottom 0.61: R1.2 R2.2 | R2.2 R5.2 R30.2 | IC1.2 C1.2 31.75,52.07 30.48,50.8 24.13,50.8 22.86,52.07 22.86,57.15 | R3.1 34.29,33.66 31.11,33.66 27.3,37.47 22.23,37.47 20.95,38.73 20.95,43.81 18.41,46.35 18.41,55.88 20.95,58.42 21.59,58.42 | R30.2 22.86,59.69 | R31.2 22.86,59.69 | R30.2 R2.2 | R31.2 22.86,57.15 | 22.86,57.15 21.59,58.42 | 22.86,59.69 21.59,58.42 | 21.59,58.42 R31.2
N$LIN-CV1  (1 unrouted)
  Top 0.61: R32.2 20.32,30.48 21.59,29.21 25.4,29.21 29.21,33.02 29.21,38.1 T1.1
  Bottom 0.61: IC1.6 C2.2 41.91,50.16 38.1,46.35 32.38,46.35 29.84,43.81 29.84,41.91 31.11,40.64 T1.1 | 16.51,20.32 R33.2 15.88,20.95 | R32.2 19.05,29.21 16.51,26.67 16.51,21.59 | 16.51,21.59 16.51,20.32 | 15.88,20.95 16.51,21.59 | 16.51,21.59 17.14,20.95 | 17.14,20.95 R65.2 16.51,20.32 | 17.14,20.95 16.51,20.32 | 16.51,20.32 15.88,20.95
N$PULSE-OUT1  (1 unrouted)
  Bottom 0.61: 93.92,31.75 X11.1 | R60.2 85.09,31.75 | 87.63,31.75 93.98,31.75 | R61.2 86.36,33.02 | 86.36,33.02 86.36,31.75 | 86.36,31.75 85.09,31.75 | 85.09,31.75 85.72,32.38 | 85.72,32.38 86.36,33.02 | 86.36,33.02 87,32.38 | 87,32.38 87.63,31.75 | 87.63,31.75 86.36,31.75 | 86.36,31.75 87,32.38 | 87,32.38 85.72,32.38 | 85.72,32.38 86.36,31.75
N$PW-CV1
  Bottom 0.61: R53.2 R54.2 R55.2 62.23,15.24 64.77,17.78 67.31,17.78 73.66,11.43 73.66,5.08 74.93,3.81 83.82,3.81 86.36,6.35 IC4.3
N$SAW-OUT1
  Bottom 0.61: R26.1 60.96,78.74 | 60.96,78.74 60.33,78.11 | 60.33,78.11 59.69,77.47 | 59.69,77.47 58.42,76.2 58.42,71.12 62.23,67.31 IC2.1 62.23,64.77 59.05,61.59 | D4.A 70.48,61.59 69.85,60.96 69.85,55.88 R22.2 67.31,52.07 | X12.2 86.4,52.03 85.09,53.34 85.09,64.77 82.55,67.31 80.01,67.31 77.47,69.85 77.47,73.66 76.2,74.93 73.66,74.93 72.39,76.2 72.39,81.92 71.12,83.19 60.96,83.19 59.69,81.92 59.69,80.01 | 59.69,79.38 59.69,78.74 | 59.69,78.74 59.69,77.47 | 60.33,78.74 59.69,78.74 | 59.69,78.74 60.33,78.11 | 60.33,78.11 60.33,78.74 | 60.33,78.74 60.96,78.74 | 60.96,78.74 59.69,80.01 | 59.69,80.01 59.69,79.38 | 59.69,79.38 60.33,78.74 | R21.2 58.42,60.96 | 67.31,52.07 67.94,51.44 | 67.94,51.44 R56.1 | 59.05,61.59 58.42,60.96 | 58.42,60.96 59.05,60.33 | 59.05,60.33 59.69,59.69 59.69,52.07 60.96,50.8 66.04,50.8 66.67,51.44 | 66.67,51.44 67.31,52.07 | 59.05,61.59 59.05,60.33 | 66.67,51.44 67.94,51.44
N$SAW-OUT2
  Bottom 0.61: R27.2 63.5,76.2 | 63.5,76.2 64.77,74.93 | R62.2 67.31,81.28 64.77,78.74 64.77,77.47 | 64.77,77.47 64.77,76.83 | 64.77,76.83 64.77,75.56 | 64.77,75.56 64.77,74.93 | 63.5,76.2 64.77,77.47 | 64.77,76.83 64.14,76.2 64.77,75.56 | D3.A 74.3,62.87 | 74.3,62.87 73.66,63.5 | 73.66,63.5 72.39,64.77 72.39,67.31 71.12,68.58 68.58,68.58 64.77,72.39 IC2.7 64.77,74.93 | X12.1 83.78,47.03 82.55,48.26 82.55,63.5 81.28,64.77 76.2,64.77 74.93,63.5 | 74.93,63.5 74.3,62.87 | 73.66,63.5 74.93,63.5
N$SINE-OUT1
  Bottom 0.61: R50.1 76.2,24.13 78.11,26.04 78.11,31.11 81.92,34.92 81.92,35.56 83.19,36.83 X11.2
N$TRI-OUT1
  Bottom 0.61: 74.3,41.27 74.3,37.47 73.66,36.83 R35.2 69.85,36.83 IC3.1 67.31,31.75 69.22,29.84 69.22,22.86 66.04,19.68 53.98,19.68 53.34,19.05 | 74.3,41.27 73.66,41.91 | 73.66,41.91 R37.2 | R47.A 52.7,18.41 | 52.7,18.41 53.34,17.78 | 53.34,17.78 R47.S | 53.34,19.05 52.7,18.41 | 53.34,19.05 53.34,17.78 | 74.3,42.55 74.3,50.16 75.56,51.44 78.74,51.44 80.01,50.16 80.01,44.45 82.63,41.83 X11.3 | 74.3,42.55 74.3,41.27 | 73.66,41.91 74.3,42.55
VCC
  Top 0.61: 33.02,83.82 58.42,83.82 60.33,81.92 60.33,75.56 IC2.8 62.23,73.03 63.5,71.75 73.41,71.75 C15.+ 81.53,72.64 84.45,75.56 94.61,75.56 96.52,73.66 96.52,63.5 | 94.08,62.23 X13.1 | X15.3 19.68,3.17 | 20.32,2.54 26.04,2.54 27.3,3.81 27.3,7.62 34.29,14.61 34.29,20.95 R42.2 37.47,24.13 R41.2 41.27,24.13 45.72,28.57 52.7,28.57 R38.2 54.61,29.21 64.77,29.21 IC3.8 69.22,26.67 | 69.22,26.67 69.85,26.67 | 69.85,26.67 70.48,26.67 | 70.48,26.67 71.37,26.67 C17.+ | IC5.8 31.75,82.55 | 31.75,82.55 31.11,83.19 | 31.11,83.19 30.48,83.82 | 30.48,83.82 17.78,83.82 15.24,81.28 15.24,76.2 8.89,69.85 X1.3 4.45,69.85 2.54,67.94 2.54,62.23 | 2.54,62.23 2.54,61.59 | 2.54,61.59 2.54,60.96 | 2.54,60.96 3.17,60.96 | 3.17,60.96 3.81,60.96 | 3.81,60.96 X2.3 | 19.05,2.54 9.53,2.54 8.26,3.81 8.26,4.45 2.54,10.16 2.54,59.69 | 2.54,60.33 2.54,60.96 | R11.2 34.29,52.07 36.83,54.61 IC1.4 36.83,59.05 38.73,60.96 46.35,60.96 48.51,58.8 C13.+ 52.96,58.8 54.61,57.15 | 54.61,57.15 54.61,56.52 | 54.61,56.52 R13.1 55.24,55.88 | 55.88,55.88 C4.2 59.05,55.88 60.33,54.61 60.33,50.16 62.23,48.26 | 62.23,48.26 62.23,47.62 | 62.23,47.62 R23.2 | 94.08,62.23 85.09,62.23 83.82,60.96 83.82,55.88 80.01,52.07 80.01,48.26 78.74,46.99 69.22,46.99 67.94,48.26 62.87,48.26 | 62.87,48.26 62.23,48.26 | IC4.8 81.28,17.78 82.55,16.51 90.17,16.51 92.08,18.41 93.09,18.41 C19.+ 96.52,21.84 96.52,60.96 | 96.52,62.23 96.52,60.96 | R51.1 60.96,15.24 63.5,17.78 67.31,17.78 69.85,20.32 69.85,26.04 | 69.85,26.04 69.85,26.67 | 30.48,83.82 31.75,83.82 | 31.75,83.82 33.02,83.82 | 33.02,83.82 32.38,83.19 | 32.38,83.19 31.75,82.55 | 31.75,82.55 31.75,83.82
  Top 0.61: 31.75,83.82 32.38,83.19 | 32.38,83.19 31.11,83.19 | 31.11,83.19 31.75,83.82 | 54.61,56.52 55.24,55.88 | 55.24,55.88 55.88,55.88 | 55.88,55.88 54.61,57.15 | 62.23,47.62 62.87,48.26 | 20.32,2.54 19.68,3.17 | 19.68,3.17 19.05,2.54 | 19.05,2.54 20.32,2.54 | 94.08,62.23 95.25,62.23 | 95.89,62.23 96.52,62.23 | 95.25,62.23 95.89,61.59 | 95.89,61.59 96.52,60.96 | 96.52,62.87 96.52,63.5 | 96.52,63.5 95.25,62.23 | 95.25,62.23 95.89,62.23 | 95.89,62.23 96.52,62.87 | 96.52,62.87 96.52,62.23 | 96.52,62.23 95.89,61.59 | 2.54,61.59 3.17,60.96 | 3.17,60.96 2.54,60.33 | 2.54,60.33 2.54,59.69 | 2.54,59.69 3.81,60.96 | 3.81,60.96 2.54,62.23 | 69.22,26.67 69.85,26.04 | 69.85,26.04 70.48,26.67
  Bottom 0.61: C4.2 R13.1
VEE
  Top 0.61: X13.3 85.01,72.31 80.64,67.94 80.64,63.5 | 80.64,62.87 80.64,62.23 | 80.64,62.23 80.64,61.59 | R36.1 79.38,62.23 | 79.38,62.23 80.01,62.23 | 80.01,62.23 80.64,62.23 | R36.1 77.47,63.25 C16.- 70.23,66.42 IC2.4 69.85,67.31 | 69.85,67.31 68.58,68.58 60.96,68.58 | 60.96,68.58 60.33,68.58 | 60.33,68.58 57.78,71.12 57.78,79.38 R18.1 | 60.33,67.94 58.67,65.66 C14.- 49.15,65.66 46.99,63.5 37.47,63.5 | 60.33,67.94 60.96,68.58 | 37.47,63.5 36.83,64.14 | IC1.11 36.83,64.14 | 36.83,64.14 36.2,63.5 | 36.2,63.5 27.94,63.5 | 27.94,63.5 26.67,64.77 | 26.67,64.77 26.67,69.85 IC5.4 | X1.1 9.53,64.77 10.16,64.14 10.16,57.78 | 88.9,10.16 88.9,6.99 86.36,4.45 74.93,4.45 71.12,8.26 R52.2 71.12,15.24 76.2,20.32 76.2,32.38 74.3,34.29 72.14,34.29 C18.- 70.74,33.91 68.58,31.75 60.96,31.75 59.69,33.02 | 88.9,10.16 88.9,10.79 | 88.9,10.79 IC4.4 89.53,11.43 | 90.17,11.43 92.96,11.43 C20.- | 59.69,33.02 59.69,33.66 | 59.69,33.66 IC3.4 59.05,34.29 | 58.42,34.29 53.98,34.29 50.8,31.11 36.2,31.11 R49.1 29.21,26.67 27.3,24.77 27.3,11.43 26.04,10.16 | 25.4,9.53 24.77,8.89 | 24.77,8.89 X15.1 | 80.01,62.23 80.64,62.87 | 80.64,62.87 80.64,63.5 | 80.64,63.5 79.38,62.23 | 79.38,62.23 80.01,61.59 | 80.64,60.96 80.64,61.59 | 80.64,61.59 80.01,62.23 | 80.01,62.23 80.01,61.59 | 80.01,61.59 80.64,60.96 | 80.64,60.96 C8.2 | 69.85,67.31 70.48,66.67 74.3,66.67 77.47,63.5 R36.1 | 60.33,67.94 60.33,68.58 | 36.2,63.5 37.47,63.5 | X2.1 8.26,55.88 | 8.26,55.88 8.89,56.52 | 8.89,56.52 9.53,57.15 | 9.53,57.15 10.16,57.78 | 59.69,33.02 58.42,34.29 | 58.42,34.29 59.05,34.29 | 59.05,34.29 59.69,33.66 | 88.9,10.79 89.53,11.43 | 89.53,11.43 90.17,11.43 | 90.17,11.43 88.9,10.16 | 24.77,8.89 24.13,9.53
  Top 0.61: 24.13,9.53 23.5,10.16 | 23.5,10.16 5.08,10.16 3.81,11.43 3.81,27.94 4.45,28.57 9.53,28.57 10.16,29.21 10.16,49.53 | 10.16,50.8 10.16,52.07 | 10.16,52.07 10.16,53.98 | 10.16,53.98 10.16,55.24 | 10.16,55.24 10.16,55.88 | 10.16,56.52 10.16,57.78 | 8.26,55.88 9.53,54.61 | 9.53,54.61 10.16,53.98 | 10.16,55.88 8.89,55.88 | 8.89,55.88 8.89,56.52 | 8.89,56.52 9.53,56.52 10.16,55.88 | 10.16,55.88 10.16,56.52 | 10.16,56.52 9.53,57.15 | 9.53,57.15 9.53,54.61 | 9.53,54.61 10.16,55.24 | 10.16,55.24 9.53,55.24 8.89,55.88 | 23.5,10.16 24.77,10.16 | 24.77,10.16 26.04,10.16 | 26.04,10.16 25.4,9.53 | 25.4,9.53 24.13,9.53 | 24.13,9.53 24.77,10.16 | 24.77,10.16 25.4,9.53 | 27.94,63.5 26.67,62.23 | 26.67,62.23 26.67,58.42 24.77,56.52 20.32,56.52 19.05,55.24 19.05,52.07 17.78,50.8 11.43,50.8 | 11.43,50.8 10.16,50.8 | 10.16,52.07 10.79,51.44 | 10.79,51.44 11.43,50.8 | 11.43,50.8 10.79,50.16 | 10.79,50.16 10.16,49.53 | 10.16,49.53 10.16,50.8 | 10.16,50.8 10.79,50.16 | 10.79,50.16 10.79,51.44 | 10.79,51.44 10.16,50.8 | 26.67,62.23 26.67,62.87 | 26.67,62.87 26.67,64.14 | 26.67,64.77 26.67,64.14 | 26.67,64.14 27.3,63.5 26.67,62.87

### Text on the board
tNames: APRIL 2016 / MICHD / VOLT CONTR OSC | PORTA POT | -5V | 0V | COARSE POT | SAW / OFFSET | +5V | FINE POT | SAW | 1V/OCT | RMP | FM1 | HIGH / FREQ | TRI | FM2 | 1V/OCT | TRI / OFFSET | SIN | PLS | FM1 E/L SW | SINE / SYMMETRY | FM1 D. POT | FM2 D. POT | SINE / ROUNDNESS | FM2 E/L SW | LIN DET POT | PW POT | PWM / DEPTH / POT | SYNC IN | PW IN